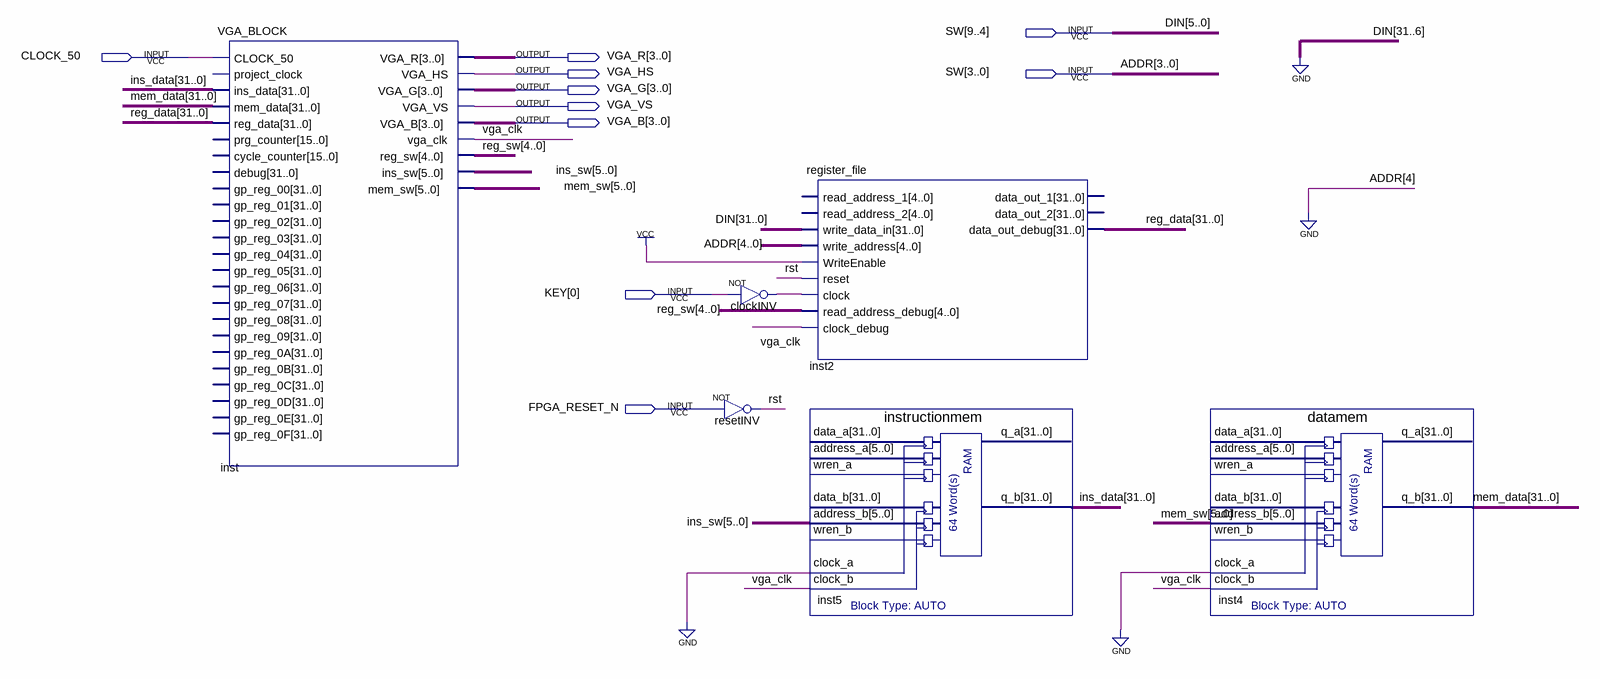
[diagram p0: schematic sheet]
// Quartus schematic lab4top.bdf as structural Verilog: 6 symbols, 10 pins
module lab4top (
  input  [9:0] SW,
  input  CLOCK_50,
  input  [0:0] KEY,
  input  FPGA_RESET_N,
  output [3:0] VGA_R,
  output VGA_HS,
  output [3:0] VGA_G,
  output VGA_VS,
  output [3:0] VGA_B
);

  wire clockINV_out, rst, vga_clk;
  wire [4:0] reg_sw;
  wire [5:0] ins_sw, mem_sw;
  wire [31:0] ins_data, mem_data, reg_data;

  VGA_BLOCK inst (
    .CLOCK_50(CLOCK_50), .ins_data(ins_data), .mem_data(mem_data), .reg_data(reg_data), .VGA_R(VGA_R),
    .VGA_HS(VGA_HS), .VGA_G(VGA_G), .VGA_VS(VGA_VS), .VGA_B(VGA_B), .vga_clk(vga_clk), .reg_sw(reg_sw),
    .ins_sw(ins_sw), .mem_sw(mem_sw));  // open: project_clock, prg_counter, cycle_counter, debug, gp_reg_00, gp_reg_01, gp_reg_02, gp_reg_03, gp_reg_04, gp_reg_05, gp_reg_06, gp_reg_07, gp_reg_08, gp_reg_09, gp_reg_0A, gp_reg_0B, gp_reg_0C, gp_reg_0D, gp_reg_0E, gp_reg_0F
  not clockINV (clockINV_out, KEY[0]);
  not resetINV (rst, FPGA_RESET_N);
  register_file inst2 (
    .write_data_in({{26{1'b0}}, SW[9:4]}), .write_address({1'b0, SW[3:0]}), .WriteEnable(1'b1), .reset(rst),
    .clock(clockINV_out), .read_address_debug(reg_sw), .clock_debug(vga_clk), .data_out_debug(reg_data));  // open: read_address_1, read_address_2, data_out_1, data_out_2
  instructionmem inst5 (
    .address_b(ins_sw), .clock_a(1'b0), .clock_b(vga_clk), .q_b(ins_data));  // open: data_a, address_a, wren_a, data_b, wren_b, q_a
  datamem inst4 (
    .address_b(mem_sw), .clock_a(1'b0), .clock_b(vga_clk), .q_b(mem_data));  // open: data_a, address_a, wren_a, data_b, wren_b, q_a

  // Other names for the same wires on the sheet: ADDR[3:0] = SW[3:0]; DIN[5:0] = SW[9:4]
endmodule
